# EAGLE schematic STM32L476RG (EAGLE 9.5.2)
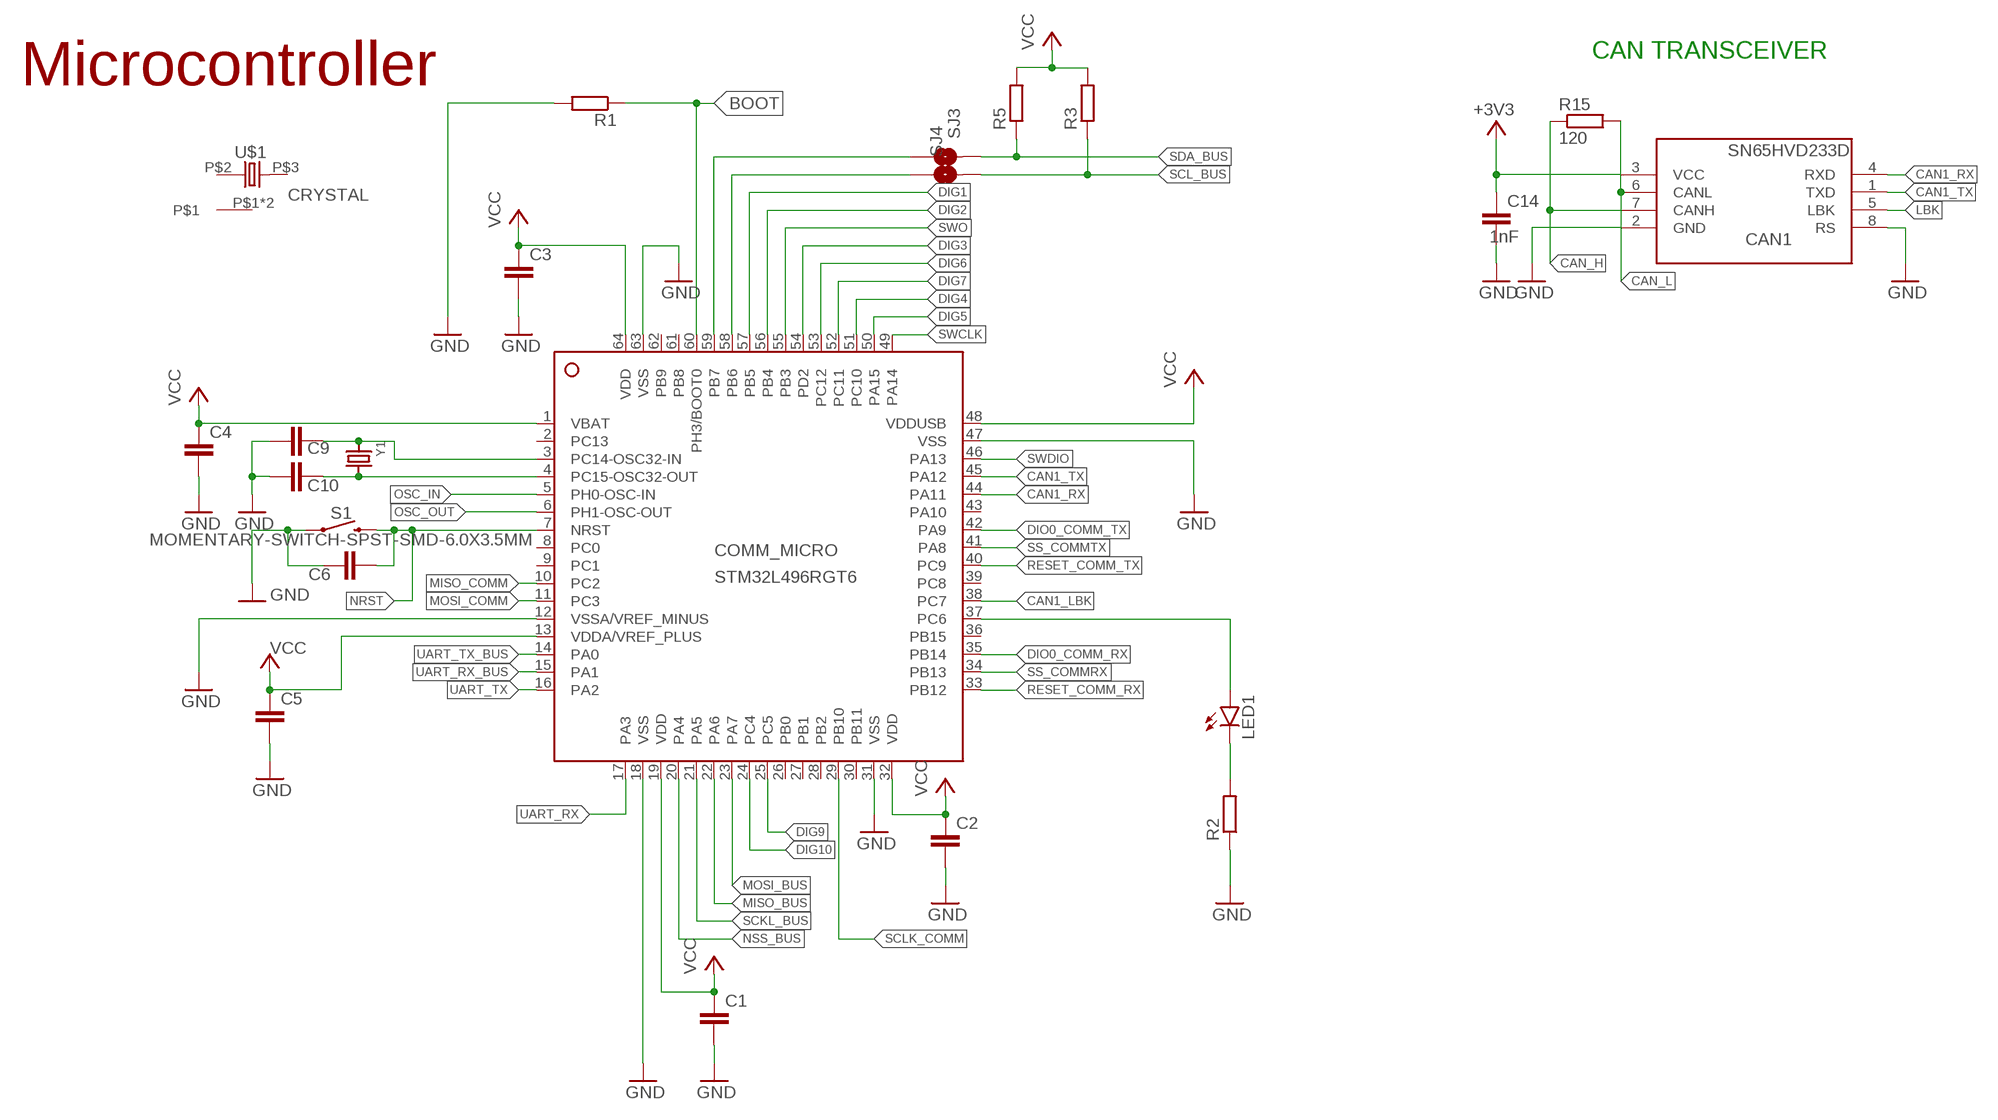
[diagram p0: schematic, sheet 1]

## Parts
C1  C-EUC0805  [C0805]
C2  C-EUC0805  [C0805]
C3  C-EUC0805  [C0805]
C4  C-EUC0805  [C0805]
C5  C-EUC0805  [C0805]
C6  C-EUC0805  [C0805]
C9  C-EUC0805  [C0805]
C10  C-EUC0805  [C0805]
C14  1nF  C-EUC1206  [C1206]
CAN1  SN65HVD233D  [SOIC8]
COMM_MICRO  STM32L496RGT6  [LQFP64_10X10]
LED1  LEDCHIP-LED0805  [CHIP-LED0805]
R1  R-EU_R0805  [R0805]
R2  R-EU_R0805  [R0805]
R3  R-EU_R0805  [R0805]
R5  R-EU_R0805  [R0805]
R15  120  R-EU_R1206  [R1206]
S1  MOMENTARY-SWITCH-SPST-SMD-6.0X3.5MM  [TACTILE_SWITCH_SMD_6.0X3.5MM]
SJ3  SMD-JUMPER-2  [SMD-JUMPER-2]
SJ4  SMD-JUMPER-2  [SMD-JUMPER-2]
U$1  CRYSTAL  [CRYSTAL_SMD]
Y1  CRYSTAL8X3.8SMT  [CRYSTAL_8X3.8]

## Nets
+3V3: C14.1 CAN1.3(VCC)
BOOT: COMM_MICRO.60(PH3/BOOT0) R1.1
CAN1_LBK: COMM_MICRO.38(PC7)
CAN1_RX: CAN1.4(RXD) COMM_MICRO.44(PA11)
CAN1_TX: CAN1.1(TXD) COMM_MICRO.45(PA12)
CAN_H: CAN1.7(CANH) R15.1
CAN_L: CAN1.6(CANL) R15.2
DIG1: COMM_MICRO.57(PB5)
DIG2: COMM_MICRO.56(PB4)
DIG3: COMM_MICRO.54(PD2)
DIG4: COMM_MICRO.51(PC10)
DIG5: COMM_MICRO.50(PA15)
DIG6: COMM_MICRO.53(PC12)
DIG7: COMM_MICRO.52(PC11)
DIG9: COMM_MICRO.25(PC5)
DIG10: COMM_MICRO.24(PC4)
DIO0_COMM_RX: COMM_MICRO.35(PB14)
DIO0_COMM_TX: COMM_MICRO.42(PA9)
GND: C1.2 C2.2 C3.2 C4.2 C5.2 C6.1 C9.1 C10.1 C14.2 CAN1.2(GND) CAN1.8(RS) COMM_MICRO.12(VSSA/VREF_MINUS) COMM_MICRO.18(VSS) COMM_MICRO.31(VSS) COMM_MICRO.47(VSS) COMM_MICRO.63(VSS) R1.2 R2.1 S1.1
LBK: CAN1.5(LBK)
MISO_BUS: COMM_MICRO.22(PA6)
MISO_COMM: COMM_MICRO.10(PC2)
MOSI_BUS: COMM_MICRO.23(PA7)
MOSI_COMM: COMM_MICRO.11(PC3)
N$2: COMM_MICRO.37(PC6) LED1.A
N$3: LED1.C R2.2
N$4: C9.2 COMM_MICRO.3(PC14-OSC32-IN) Y1.P$1
N$5: C10.2 COMM_MICRO.4(PC15-OSC32-OUT) Y1.P$4
N$8: COMM_MICRO.59(PB7) SJ3.1
N$9: COMM_MICRO.58(PB6) SJ4.1
NRST: C6.2 COMM_MICRO.7(NRST) S1.2
NSS_BUS: COMM_MICRO.20(PA4)
OSC_IN: COMM_MICRO.5(PH0-OSC-IN)
OSC_OUT: COMM_MICRO.6(PH1-OSC-OUT)
RESET_COMM_RX: COMM_MICRO.33(PB12)
RESET_COMM_TX: COMM_MICRO.40(PC9)
SCKL_BUS: COMM_MICRO.21(PA5)
SCL_BUS: R3.1 SJ4.2
SCLK_COMM: COMM_MICRO.29(PB10)
SDA_BUS: R5.1 SJ3.2
SS_COMMRX: COMM_MICRO.34(PB13)
SS_COMMTX: COMM_MICRO.41(PA8)
SWCLK: COMM_MICRO.49(PA14)
SWDIO: COMM_MICRO.46(PA13)
SWO: COMM_MICRO.55(PB3)
UART_RX: COMM_MICRO.17(PA3)
UART_RX_BUS: COMM_MICRO.15(PA1)
UART_TX: COMM_MICRO.16(PA2)
UART_TX_BUS: COMM_MICRO.14(PA0)
VCC: C1.1 C2.1 C3.1 C4.1 C5.1 COMM_MICRO.1(VBAT) COMM_MICRO.13(VDDA/VREF_PLUS) COMM_MICRO.19(VDD) COMM_MICRO.32(VDD) COMM_MICRO.48(VDDUSB) COMM_MICRO.64(VDD) R3.2 R5.2
Unconnected: COMM_MICRO.2(PC13) COMM_MICRO.8(PC0) COMM_MICRO.9(PC1) COMM_MICRO.26(PB0) COMM_MICRO.27(PB1) COMM_MICRO.28(PB2) COMM_MICRO.30(PB11) COMM_MICRO.36(PB15) COMM_MICRO.39(PC8) COMM_MICRO.43(PA10) COMM_MICRO.61(PB8) COMM_MICRO.62(PB9) U$1.P$1 U$1.P$2 U$1.P$3 U$1.P$4

## Notes on the sheet
- CAN TRANSCEIVER
- Microcontroller

## Library data of the parts
C1-C6 C9 C10 C14 = rcl:C-EU: CAPACITOR, European symbol; SPICEPREFIX: C
CAN1 = SN65HVD233D:SN65HVD233D; AVAILABILITY: Unavailable; DESCRIPTION: 3.3V CAN Transceiver with Standby Mode, Loop-back 8-SOIC -40 to 125; MF: Texas Instruments; MP: SN65HVD233D; PACKAGE: SOIC-8 Texas Instruments; PRICE: None
COMM_MICRO = STM32L4xxx:STM32L496R*: STM32L496RX LQFP64 Cortex M4, 80MHz, 512kB-1024kB Flash, 320kB SRAM Datasheet STM32L496XX <http://www.st.com/content/ccc/resource/technical/document/datasheet/group3/3f/73/19/d1/d4/9e/48/34/DM00284211/files/DM00284211.pdf/jcr:content/translations/en.DM00284211.pdf>; FARNELL: 2725138; FLASH: 1024kB; SRAM: 320kB
LED1 = led:LED: LED OSRAM: - CHIPLED LG R971, LG N971, LY N971, LG Q971, LY Q971, LO R971, LY R971 LH N974, LH R974 LS Q976, LO Q976, LY Q976 LO Q996 - Hyper CHIPLED LW Q18S LB Q993, LB Q99A, LB R99A - SideLED LS A670, LO A670, LY A670, LG A670, LP A670 LB A673, LV A673, LT A673, LW A673 LH A674 LY A675 LS A676, LA A676, LO A676, LY A676, LW A676 LS A679, LY A679, LG A679 - Hyper Micro SIDELED® LS Y876, LA Y876, LO Y876, LY Y876 LT Y87S - SmartLED LW L88C, LW L88S LB L89C, LB L89S, LG L890 LS L89K, LO L89K, LY L89K LS L896, LA L896, LO L896, LY L896 - TOPLED LS T670, LO T670, LY T670, LG T670, LP T670 LSG T670, LSP T670, LSY T670, LOP T670, LYG T670 LG T671, LOG T671, LSG T671 LB T673, LV T673, LT T673, LW T673 LH T674 LS T676, LA T676, LO T676, LY T676, LB T676, LH T676, LSB T676, LW T676 LB T67C, LV T67C, LT T67C, LS T67K, LO T67K, LY T67K, LW E67C LS E67B, LA E67B, LO E67B, LY E67B, LB E67C, LV E67C, LT E67C LW T67C LS T679, LY T679, LG T679 LS T770, LO T770, LY T770, LG T770, LP T770 LB T773, LV T773, LT T773, LW T773 LH T774 LS E675, LA E675, LY E675, LS T675 LS T776, LA T776, LO T776, LY T776, LB T776 LHGB T686 LT T68C, LB T68C - Hyper Mini TOPLED® LB M676 - Mini TOPLED Santana® LG M470 LS M47K, LO M47K, LY M47K Source: http://www.osram.convergy.de LUXEON: - LUMILED® LXK2-PW12-R00, LXK2-PW12-S00, LXK2-PW14-U00, LXK2-PW14-V00 LXK2-PM12-R00, LXK2-PM12-S00, LXK2-PM14-U00 LXK2-PE12-Q00, LXK2-PE12-R00, LXK2-PE12-S00, LXK2-PE14-T00, LXK2-PE14-U00 LXK2-PB12-K00, LXK2-PB12-L00, LXK2-PB12-M00, LXK2-PB14-N00, LXK2-PB14-P00, LXK2-PB14-Q00 LXK2-PR12-L00, LXK2-PR12-M00, LXK2-PR14-Q00, LXK2-PR14-R00 LXK2-PD12-Q00, LXK2-PD12-R00, LXK2-PD12-S00 LXK2-PH12-R00, LXK2-PH12-S00 LXK2-PL12-P00, LXK2-PL12-Q00, LXK2-PL12-R00 Source: www.luxeon.com KINGBRIGHT: KA-3528ASYC Source: www.kingbright.com
R1-R3 R5 R15 = rcl:R-EU_: RESISTOR, European symbol; SPICEPREFIX: R
S1 = SparkFun-Switches:MOMENTARY-SWITCH-SPST: Momentary Switch (Pushbutton) - SPST Normally-open (NO) SPST momentary switches (buttons, pushbuttons). Variants PTH-12MM - 12mm square, through-hole Momentary Pushbutton Switch - 12mm Square <https://www.sparkfun.com/products/9190> (COM-09190) PTH-6.0MM, PTH-6.0MM-KIT - 6.0mm square, through-hole Mini Pushbutton Switch <https://www.sparkfun.com/products/97> (COM-00097) KIT package intended for soldering kit's - only one side of pads' copper is exposed. PTH-RIGHT-ANGLE-KIT - Right-angle, through-hole Right Angle Tactile Button <https://www.sparkfun.com/products/10791> - Used on SparkFun BigTime Watch Kit <https://www.sparkfun.com/products/11734> SMD-12MM - 12mm square, surface-mount Tactile Button - SMD (12mm) <https://www.sparkfun.com/products/12993> (COM-12993) Used on SparkFun PicoBoard <https://www.sparkfun.com/products/11888> SMD-4.5MM - 4.5mm Square Trackball Switch Used on SparkFun Blackberry Trackballer Breakout <https://www.sparkfun.com/products/13169> SMD-4.6MMX2.8MM - 4.60mm x 2.80mm, surface mount Used on SparkFun SAMD21 Mini Breakout <https://www.sparkfun.com/products/13664> SMD-5.2MM, SMD-5.2-REDUNDANT - 5.2mm square, surface-mount Mini Pushbutton Switch - SMD <https://www.sparkfun.com/products/8720> (COM-08720) Used on Arduino Pro Mini <https://www.sparkfun.com/products/11114> REDUNDANT package connects both switch circuits together SMD-6.0X3.5MM - 6.0 x 3.5mm, surface mount Momentary Reset Switch SMD <https://www.sparkfun.com/products/8229> (COM-08229) SMD-6.2MM-TALL - 6.2mm square, surface mount Tactile Button - SMD (6mm) <https://www.sparkfun.com/products/12992> Used on SparkFun Digital Sandbox <https://www.sparkfun.com/products/12651> SMD-RIGHT-ANGLE - Right-angle, surface mount Used on SparkFun Block for Intel® Edison - Arduino <https://www.sparkfun.com/products/13036>; PROD_ID: SWCH-00815; SF_SKU: COM-08229
SJ3 SJ4 = FaBo-PIN:SMD-JUMPER-2
U$1 = cristal:CRYSTAL
Y1 = microbuilder:CRYSTAL: Crystals HC49UP - Surface Mount Crystal 4.0MHz 18pF +/-30ppm Surface Mount Crystal [Digikey: 535-9857-1-ND] 12.0 MHz Surface Mount Crystal [Digikey: 535-9869-6-ND] 25.0 MHz Surface Mount Crystal [Digikey: 535-9078-1-ND] 2.5 x 2.0mm - MEMs SMT Crystal 16.0 MHz 10pF 20ppm 2.5 x 2.0mm Crystal [Digikey -40-85°C: 535-10923-1-ND] 3.2 x 2.5mm - MEMs SMT Crystal 12.0 MHz 8pF 15ppm 3.2 x 2.5mm Crystal [Digikey: -10-70°C: 644-1047-1-ND -40-125°C: 644-1128-1-ND] 16.0 MHz 8pF 15ppm 3.2 x 2.5mm Crystal [Digikey: -10-70°C: 644-1049-1-ND -40-125°C: 644-1129-2-ND] 16.0 MHz 10pF 10ppm 3.2 x 2.5mm Crystal [Digikey: 644-1100-1-ND] 27.12 MHz 18pF 30ppm 3.2 x 2.5mm Crystal [Digikey: 887-1424-1-ND] 27.12MHz 10pF 10ppm 3.2 x 2.5mm Crystal [Digikey: 887-1329-1-ND] 4.9 x 1.8mm - MEMs SMT Crystal 32.768 KHz 12.5pF 20ppm 4.9 x 1.8mm Crystal [Digikey: SE2415CT-ND] 8.0 x 3.8mm - Surface Mount Crystal 32.768kHz 12.5pF 20ppm -40°C-85°C [Digikey: 535-9166-2-ND] Cylinder 32.768KHz Cylinder Crystal (2x6mm body) [Ex. Digikey: 300-8341-2-ND]